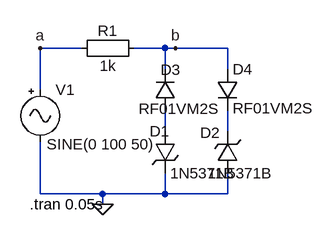
[diagram p0: schematic limiter_zener_two_sided_parallel.asc]
limiter_zener_two_sided_parallel.asc, the LTspice schematic file:
Version 4
SHEET 1 880 680
WIRE 16 112 -48 112
WIRE 144 112 96 112
WIRE 160 112 144 112
WIRE 240 112 160 112
WIRE 144 144 144 112
WIRE 240 144 240 112
WIRE -48 176 -48 112
WIRE 144 240 144 208
WIRE 240 240 240 208
WIRE -48 336 -48 256
WIRE 48 336 -48 336
WIRE 144 336 144 304
WIRE 144 336 48 336
WIRE 240 336 240 304
WIRE 240 336 144 336
WIRE 48 352 48 336
FLAG -48 112 a
FLAG 160 112 b
FLAG 48 352 0
SYMBOL zener 128 240 R0
WINDOW 0 -8 0 Left 2
SYMATTR InstName D1
SYMATTR Value 1N5371B
SYMATTR Description Diode
SYMATTR Type diode
SYMBOL Misc\\signal -48 160 R0
WINDOW 123 0 0 Left 2
WINDOW 39 0 0 Left 2
WINDOW 3 10 100 Left 2
SYMATTR Value SINE(0 100 50)
SYMATTR InstName V1
SYMBOL Misc\\EuropeanResistor 112 96 R90
WINDOW 0 5 56 VBottom 2
WINDOW 3 27 56 VTop 2
SYMATTR InstName R1
SYMATTR Value 1k
SYMBOL zener 256 304 R180
WINDOW 0 27 62 Left 2
WINDOW 3 -54 0 Left 2
SYMATTR InstName D2
SYMATTR Value 1N5371B
SYMATTR Description Diode
SYMATTR Type diode
SYMBOL diode 160 208 R180
WINDOW 0 -8 63 Left 2
WINDOW 3 -68 3 Left 2
SYMATTR InstName D3
SYMATTR Value RF01VM2S
SYMBOL diode 224 144 R0
WINDOW 3 24 60 Left 2
SYMATTR InstName D4
SYMATTR Value RF01VM2S
TEXT -64 352 Left 2 !.tran 0.05s

The netlist it stands for:
* limiter_zener_two_sided_parallel.asc
D1 N001 0 1N5371B
V1 a 0 SINE(0 100 50)
R1 b a 1k
D2 0 N002 1N5371B
D3 N001 b RF01VM2S
D4 b N002 RF01VM2S
.model D D
.lib standard.dio
.tran 0.05s
.backanno
.end